# EAGLE schematic dedica interface board (EAGLE 9.3.2)

## Sheet 1 of 2
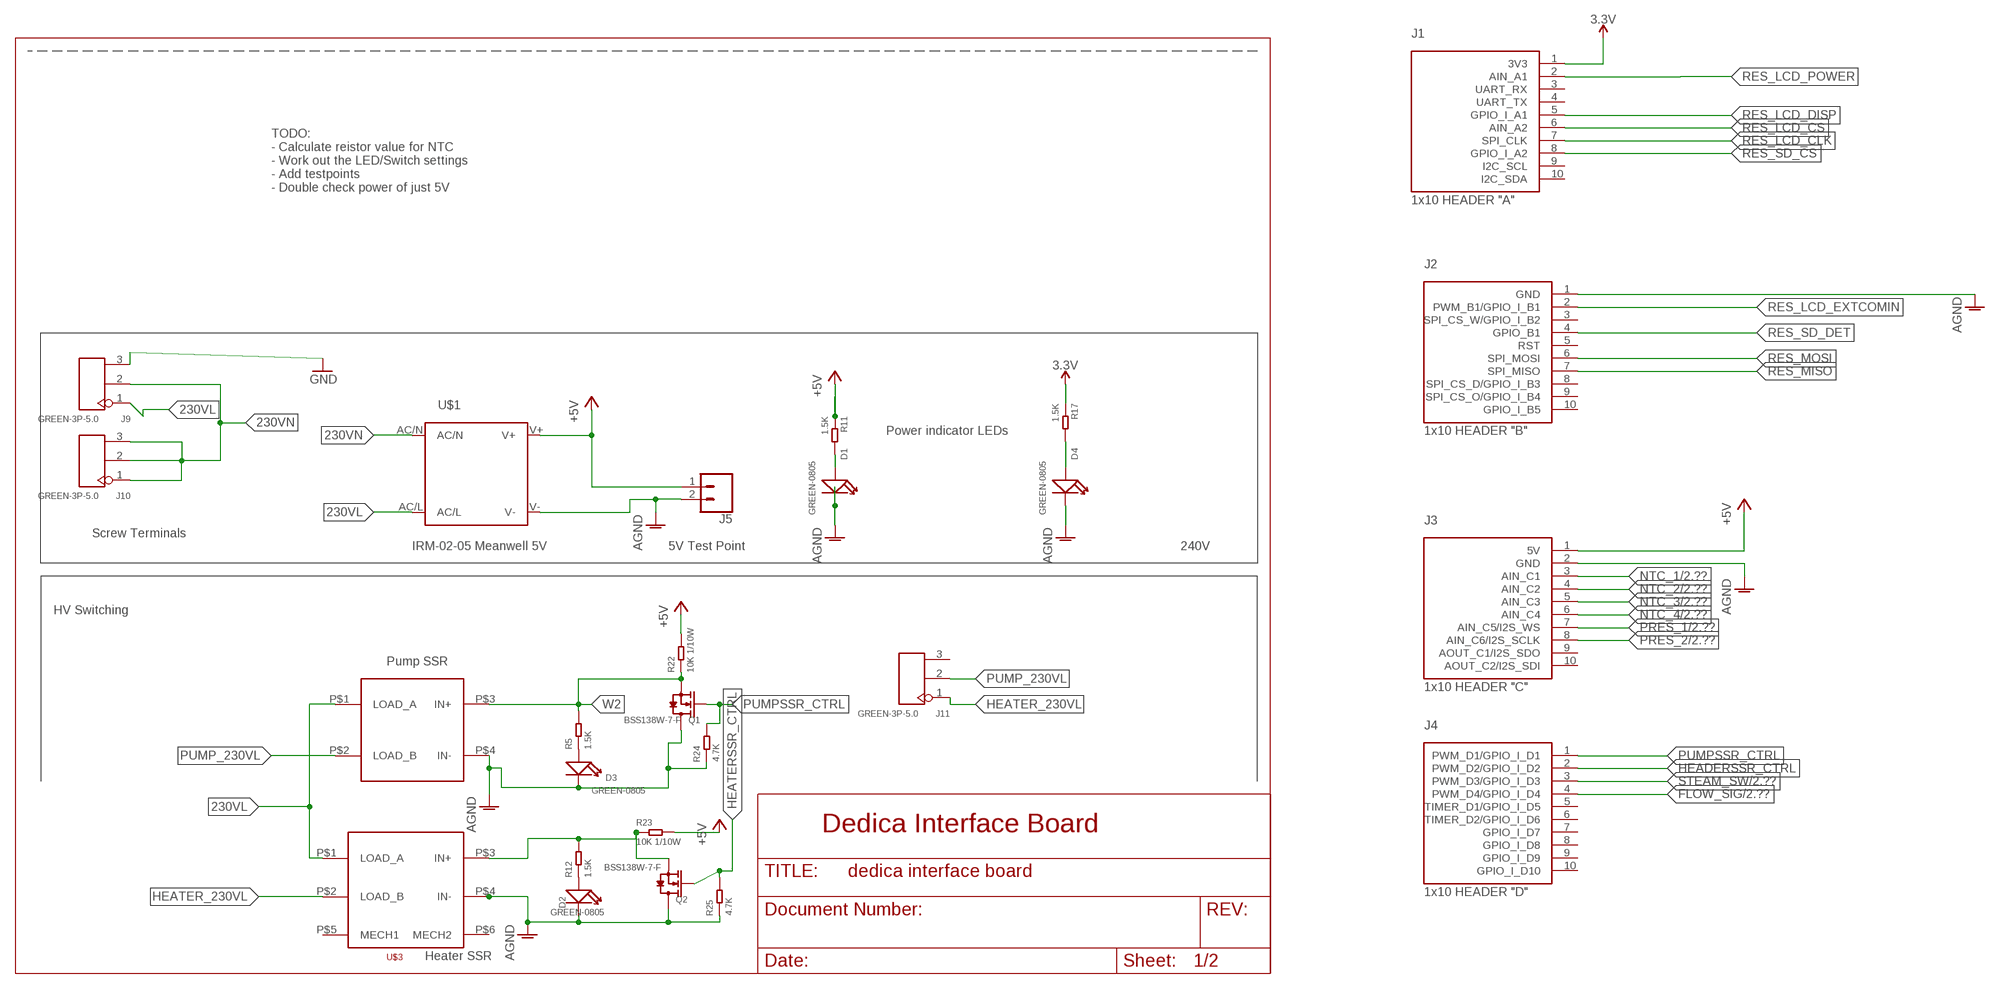
[diagram p0: schematic, sheet 1]

### Parts
D1  GREEN-0805  SMD-LED-CLEAR-GREEN(0805)  [LED-0805]
D2  GREEN-0805  SMD-LED-CLEAR-GREEN(0805)  [LED-0805]
D3  GREEN-0805  SMD-LED-CLEAR-GREEN(0805)  [LED-0805]
D4  GREEN-0805  SMD-LED-CLEAR-GREEN(0805)  [LED-0805]
J1  1x10 HEADER "A"  HEADER-1X10-J1  [1X10]
J2  1x10 HEADER "B"  HEADER-1X10-J2  [1X10]
J3  1x10 HEADER "C"  HEADER-1X10-J3  [1X10]
J4  1x10 HEADER "D"  HEADER-1X10-J4  [1X10]
J5  CONN_02  [1X02]
J9  GREEN-3P-5.0  SCREW-TERMINAL-GREEN(3P-5.0)  [H3-5.0-15.5X8.0MM]
J10  GREEN-3P-5.0  SCREW-TERMINAL-GREEN(3P-5.0)  [H3-5.0-15.5X8.0MM]
J11  GREEN-3P-5.0  SCREW-TERMINAL-GREEN(3P-5.0)  [H3-5.0-15.5X8.0MM]
Q1  BSS138W-7-F  SMD-MOSFET-N-CH-50V-200MA-BSS138W-7-F(SOT-23)  [SOT-23]
Q2  BSS138W-7-F  SMD-MOSFET-N-CH-50V-200MA-BSS138W-7-F(SOT-23)  [SOT-23]
R5  1.5K  SMD-RES-330R-5%-1/10W(0603)  [R0603]
R11  1.5K  SMD-RES-150R-5%-1/10W(0603)  [R0603]
R12  1.5K  SMD-RES-330R-5%-1/10W(0603)  [R0603]
R17  1.5K  SMD-RES-150R-5%-1/10W(0603)  [R0603]
R22  10K 1/10W  SMD-RES-10K-5%-1/10W(0603)  [R0603]
R23  10K 1/10W  SMD-RES-10K-5%-1/10W(0603)  [R0603]
R24  4.7K  SMD-RES-4.7K-5%-1/10W(0603)  [R0603]
R25  4.7K  SMD-RES-4.7K-5%-1/10W(0603)  [R0603]
U$1  IRM_01/02IRM_01/02  [IRM_01/02]
U$2  AQ3A2-ZT4/32VDC  [AQ3A2-ZT4/32VDC]
U$3  AQ10A2-ZT4/32VDC  [AQ10A2-ZT4/32VDC]

### Nets
3.3V: J1.1(3V3) R17.1 ; also sheet 2
230VL: J9.1 U$1.AC/L U$2.P$1(LOAD_A) U$3.P$1(LOAD_A)
230VN: J9.2 J10.1 J10.2 J10.3 U$1.AC/N
+5V: J3.1(5V) J5.1 R11.1 R22.2 R23.2 U$1.V+ ; also sheet 2
AGND: D1.- D2.- D3.- D4.- J2.1(GND) J3.2(GND) J5.2 Q1.3(D) Q2.3(D) R24.1 R25.1 U$1.V- U$2.P$4(IN-) U$3.P$4(IN-) ; also sheet 2
FLOW_SIG: J4.4(PWM_D4/GPIO_I_D4) ; also sheet 2
GND: J9.3
HEADERSSR_CTRL: J4.2(PWM_D2/GPIO_I_D2)
HEATER_230VL: J11.1 U$3.P$2(LOAD_B)
HEATERSSR_CTRL: Q2.1(G) R25.2
N$3: D1.+ R11.2
N$4: D3.+ R5.1
N$5: D2.+ R12.1
N$8: D4.+ R17.2
N$14: Q2.2(S) R12.2 R23.1 U$3.P$3(IN+)
NTC_1: J3.3(AIN_C1) ; also sheet 2
NTC_2: J3.4(AIN_C2) ; also sheet 2
NTC_3: J3.5(AIN_C3) ; also sheet 2
NTC_4: J3.6(AIN_C4) ; also sheet 2
PRES_1: J3.7(AIN_C5/I2S_WS) ; also sheet 2
PRES_2: J3.8(AIN_C6/I2S_SCLK) ; also sheet 2
PUMP_230VL: J11.2 U$2.P$2(LOAD_B)
PUMPSSR_CTRL: J4.1(PWM_D1/GPIO_I_D1) Q1.1(G) R24.2
RES_LCD_CLK: J1.7(SPI_CLK)
RES_LCD_CS: J1.6(AIN_A2)
RES_LCD_DISP: J1.5(GPIO_I_A1)
RES_LCD_EXTCOMIN: J2.2(PWM_B1/GPIO_I_B1)
RES_LCD_POWER: J1.2(AIN_A1)
RES_MISO: J2.7(SPI_MISO)
RES_MOSI: J2.6(SPI_MOSI)
RES_SD_CS: J1.8(GPIO_I_A2)
RES_SD_DET: J2.4(GPIO_B1)
STEAM_SW: J4.3(PWM_D3/GPIO_I_D3) ; also sheet 2
W2: Q1.2(S) R5.2 R22.1 U$2.P$3(IN+)
Unconnected: J1.3(UART_RX) J1.4(UART_TX) J1.9(I2C_SCL) J1.10(I2C_SDA) J2.3(SPI_CS_W/GPIO_I_B2) J2.5(RST) J2.8(SPI_CS_D/GPIO_I_B3) J2.9(SPI_CS_O/GPIO_I_B4) J2.10(GPIO_I_B5) J3.9(AOUT_C1/I2S_SDO) J3.10(AOUT_C2/I2S_SDI) J4.5(TIMER_D1/GPIO_I_D5) J4.6(TIMER_D2/GPIO_I_D6) J4.7(GPIO_I_D7) J4.8(GPIO_I_D8) J4.9(GPIO_I_D9) J4.10(GPIO_I_D10) J11.3 U$3.P$5(MECH1) U$3.P$6(MECH2)

### Notes on the sheet
- TODO: 
  - Calculate reistor value for NTC
  - Work out the LED/Switch settings
  - Add testpoints 
  - Double check power of just 5V
- Power indicator LEDs
- Screw Terminals
- IRM-02-05 Meanwell 5V | 5V Test Point | 240V
- HV Switching
- Pump SSR
- Dedica Interface Board
- Heater SSR

## Sheet 2 of 2
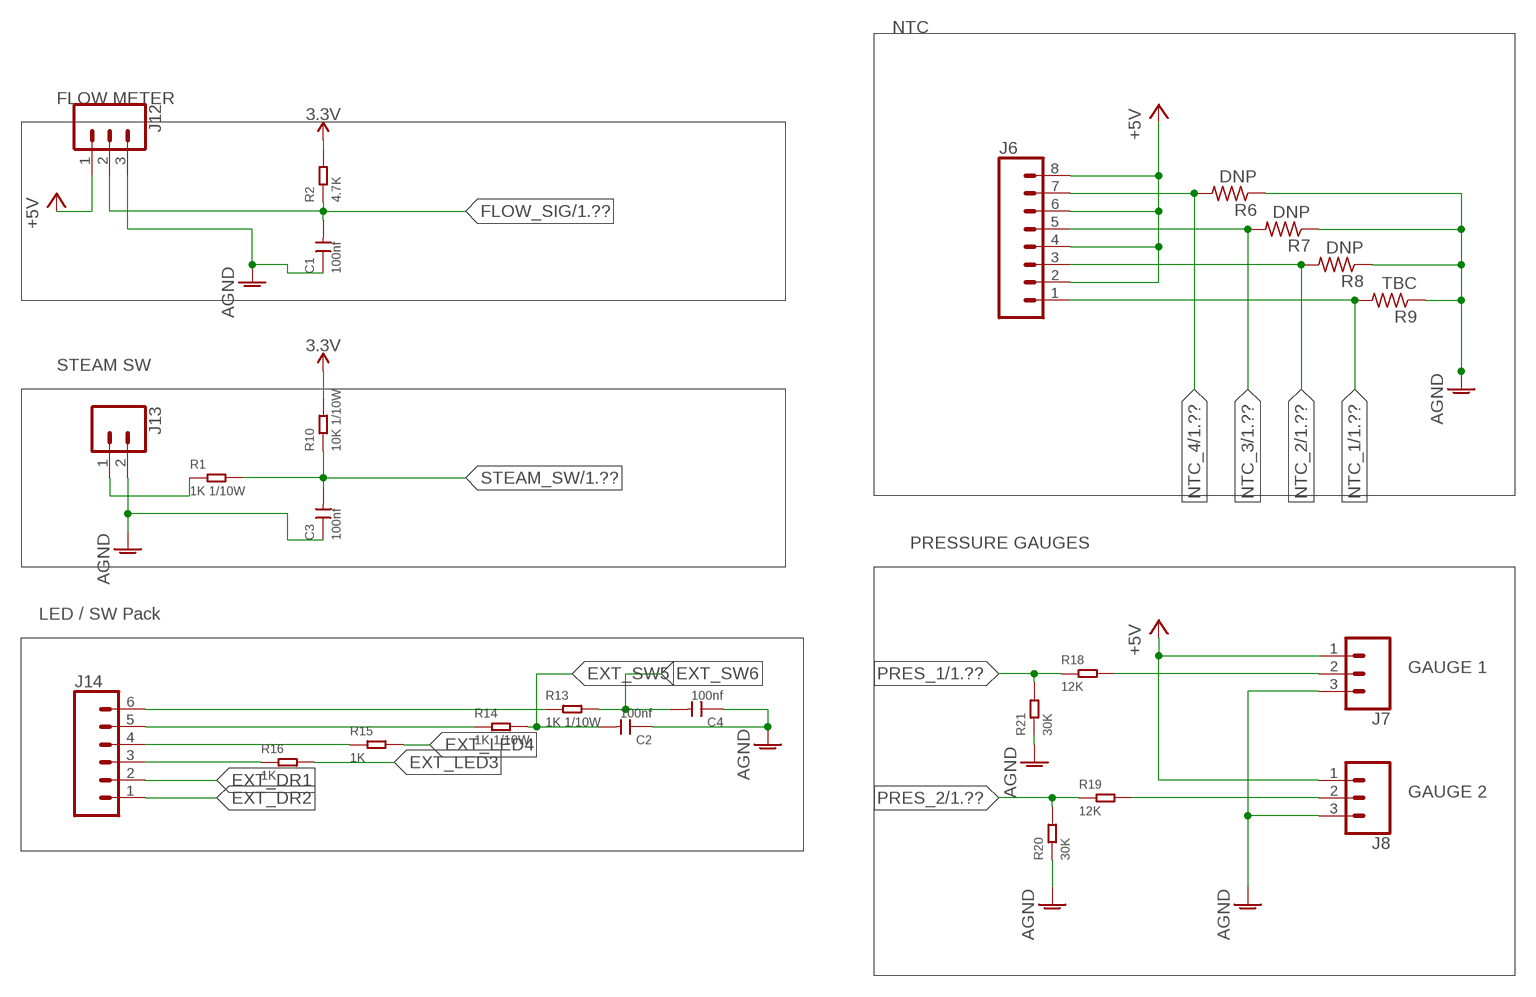
[diagram p1: schematic, sheet 2]

### Parts
C1  100nf  CERAMIC-100NF-50V-10%-X7R(0603)  [C0603]
C2  100nf  CERAMIC-100NF-50V-10%-X7R(0603)  [C0603]
C3  100nf  CERAMIC-100NF-50V-10%-X7R(0603)  [C0603]
C4  100nf  CERAMIC-100NF-50V-10%-X7R(0603)  [C0603]
J6  CONN_08"  [1X08]
J7  CONN_03  [1X03]
J8  CONN_03  [1X03]
J12  CONN_03  [1X03]
J13  CONN_02  [1X02]
J14  CONN_06LOCK  [1X06_LOCK]
R1  1K 1/10W  SMD-RES-1K-5%-1/10W(0603)  [R0603]
R2  4.7K  SMD-RES-4.7K-5%-1/10W(0603)  [R0603]
R6  DNP  R-US_R0603  [R0603]
R7  DNP  R-US_R0603  [R0603]
R8  DNP  R-US_R0603  [R0603]
R9  TBC  R-US_R0603  [R0603]
R10  10K 1/10W  SMD-RES-10K-5%-1/10W(0603)  [R0603]
R13  1K 1/10W  SMD-RES-1K-5%-1/10W(0603)  [R0603]
R14  1K 1/10W  SMD-RES-1K-5%-1/10W(0603)  [R0603]
R15  1K  SMD-RES-330R-5%-1/8W(0805)  [R0805]
R16  1K  SMD-RES-330R-5%-1/8W(0805)  [R0805]
R18  12K  SMD-RES-12K-1%-1/10W(0603)  [R0603]
R19  12K  SMD-RES-12K-1%-1/10W(0603)  [R0603]
R20  30K  SMD-RES-30K-1%-1/10W(0603)  [R0603]
R21  30K  SMD-RES-30K-1%-1/10W(0603)  [R0603]

### Nets
3.3V: R2.2 R10.2 ; also sheet 1
+5V: J6.2 J6.4 J6.6 J6.8 J7.1 J8.1 J12.1 ; also sheet 1
AGND: C1.1 C2.1 C3.1 C4.1 J7.3 J8.3 J12.3 J13.2 R6.1 R7.1 R8.1 R9.1 R20.1 R21.1 ; also sheet 1
EXT_DR1: J14.2
EXT_DR2: J14.1
EXT_LED3: R16.2
EXT_LED4: R15.2
EXT_SW5: C2.2 R14.2
EXT_SW6: C4.2 R13.2
FLOW_SIG: C1.2 J12.2 R2.1 ; also sheet 1
N$1: J13.1 R1.1
N$6: J14.6 R13.1
N$7: J14.5 R14.1
N$10: J14.4 R15.1
N$11: J14.3 R16.1
NTC_1: J6.1 R9.2 ; also sheet 1
NTC_2: J6.3 R8.2 ; also sheet 1
NTC_3: J6.5 R7.2 ; also sheet 1
NTC_4: J6.7 R6.2 ; also sheet 1
PGAUGE_1: J7.2 R18.2
PGAUGE_2: J8.2 R19.2
PRES_1: R18.1 R21.2 ; also sheet 1
PRES_2: R19.1 R20.2 ; also sheet 1
STEAM_SW: C3.2 R1.2 R10.1 ; also sheet 1

### Notes on the sheet
- NTC
- FLOW METER
- STEAM SW
- PRESSURE GAUGES
- LED / SW Pack
- GAUGE 1
- GAUGE 2

## Library data of the parts
C1-C4 = OPL_Capacitor:CERAMIC-100NF-50V-10%-X7R(0603): 302010138; MPN: CC0603KRX7R9BB104
D1-D4 = OPL_Optoelectronics:SMD-LED-CLEAR-GREEN(0805): 304090057; MPN: 17-215SYGC/S530-E2/TR8
J1 = CCo-Boost:HEADER-1X10-J1: 1x10 BoosterPack Header J1 This 1x10 header matches the pinout of J1 header of the BoosterPack Pinout Standard.
J2 = CCo-Boost:HEADER-1X10-J2: 1x10 BoosterPack Header J2 This 1x10 header matches the pinout of J2 header of the BoosterPack Pinout Standard.
J3 = CCo-Boost:HEADER-1X10-J3: 1x10 BoosterPack Header J3 This 1x10 header matches the pinout of J3 header of the BoosterPack Pinout Standard.
J4 = CCo-Boost:HEADER-1X10-J4: 1x10 BoosterPack Header J4 This 1x10 header matches the pinout of J4 header of the BoosterPack Pinout Standard.
J5 J13 = SparkFun-Connectors:CONN_02: Multi connection point. Often used as Generic Header-pin footprint for 0.1 inch spaced/style header connections On any of the 0.1 inch spaced packages, you can populate with these: Break Away Headers - Straight <https://www.sparkfun.com/products/116> (PRT-00116) Break Away Male Headers - Right Angle <https://www.sparkfun.com/products/553> (PRT-00553) Female Headers <https://www.sparkfun.com/products/115> (PRT-00115) Break Away Headers - Machine Pin <https://www.sparkfun.com/products/117> (PRT-00117) Break Away Female Headers - Swiss Machine Pin <https://www.sparkfun.com/products/743> (PRT-00743) For SCREWTERMINALS and SPRING TERMINALS visit here: Screw Terimnals on SparkFun.com <https://www.sparkfun.com/search/results?term=Screw+Terminals> (5mm/3.5mm/2.54mm spacing) This device is also useful as a general connection point to wire up your design to another part of your project. Our various solder wires solder well into these plated through hole pads. Hook-Up Wire - Assortment (Stranded, 22 AWG) <https://www.sparkfun.com/products/11375> (PRT-11375) Hook-Up Wire - Assortment (Solid Core, 22 AWG) <https://www.sparkfun.com/products/11367> (PRT-11367) View the entire wire category on our website here <https://www.sparkfun.com/categories/141> Special notes: Molex polarized connector foot print use with: PRT-08233 with associated crimp pins and housings. 2.54_SCREWTERM for use with PRT-10571. 3.5mm Screw Terminal footprints for PRT-08084 5mm Screw Terminal footprints for use with PRT-08432
J6 = SparkFun-Connectors:CONN_08: Multi connection point. Often used as Generic Header-pin footprint for 0.1 inch spaced/style header connections On any of the 0.1 inch spaced packages, you can populate with these: Break Away Headers - Straight <https://www.sparkfun.com/products/116> (PRT-00116) Break Away Male Headers - Right Angle <https://www.sparkfun.com/products/553> (PRT-00553) Female Headers <https://www.sparkfun.com/products/115> (PRT-00115) Break Away Headers - Machine Pin <https://www.sparkfun.com/products/117> (PRT-00117) Break Away Female Headers - Swiss Machine Pin <https://www.sparkfun.com/products/743> (PRT-00743) Arduino Stackable Header - 8 Pin <https://www.sparkfun.com/products/9279> (PRT-09279) For SCREWTERMINALS and SPRING TERMINALS visit here: Screw Terimnals on SparkFun.com <https://www.sparkfun.com/search/results?term=Screw+Terminals> (5mm/3.5mm/2.54mm spacing) This device is also useful as a general connection point to wire up your design to another part of your project. Our various solder wires solder well into these plated through hole pads. Hook-Up Wire - Assortment (Stranded, 22 AWG) <https://www.sparkfun.com/products/11375> (PRT-11375) Hook-Up Wire - Assortment (Solid Core, 22 AWG) <https://www.sparkfun.com/products/11367> (PRT-11367) View the entire wire category on our website here <https://www.sparkfun.com/categories/141> Special notes: Molex polarized connector foot print use with SKU : PRT-08231 with associated crimp pins and housings. 1MM SMD Version SKU: PRT-10208 NOTES ON THE VARIANTS LOCK and LOCK_LONGPADS... This footprint was designed to help hold the alignment of a through-hole component (i.e. 6-pin header) while soldering it into place. You may notice that each hole has been shifted either up or down by 0.005 of an inch from it's more standard position (which is a perfectly straight line). This slight alteration caused the pins (the squares in the middle) to touch the edges of the holes. Because they are alternating, it causes a "brace" to hold the component in place. 0.005 has proven to be the perfect amount of "off-center" position when using our standard breakaway headers. Although looks a little odd when you look at the bare footprint, once you have a header in there, the alteration is very hard to notice. Also,if you push a header all the way into place, it is covered up entirely on the bottom side.; PROD_ID: CONN-08438
J7 J8 J12 = SparkFun-Connectors:CONN_03: Multi connection point. Often used as Generic Header-pin footprint for 0.1 inch spaced/style header connections On any of the 0.1 inch spaced packages, you can populate with these: Break Away Headers - Straight <https://www.sparkfun.com/products/116> (PRT-00116) Break Away Male Headers - Right Angle <https://www.sparkfun.com/products/553> (PRT-00553) Female Headers <https://www.sparkfun.com/products/115> (PRT-00115) Break Away Headers - Machine Pin <https://www.sparkfun.com/products/117> (PRT-00117) Break Away Female Headers - Swiss Machine Pin <https://www.sparkfun.com/products/743> (PRT-00743) Stackable Header - 3 Pin (Female, 0.1") <https://www.sparkfun.com/products/13875> (PRT-13875) For SCREWTERMINALS and SPRING TERMINALS visit here: Screw Terimnals on SparkFun.com <https://www.sparkfun.com/search/results?term=Screw+Terminals> (5mm/3.5mm/2.54mm spacing) This device is also useful as a general connection point to wire up your design to another part of your project. Our various solder wires solder well into these plated through hole pads. Hook-Up Wire - Assortment (Stranded, 22 AWG) <https://www.sparkfun.com/products/11375> (PRT-11375) Hook-Up Wire - Assortment (Solid Core, 22 AWG) <https://www.sparkfun.com/products/11367> (PRT-11367) View the entire wire category on our website here <https://www.sparkfun.com/categories/141> Special notes: Molex polarized connector foot print use with SKU : PRT-08232 with associated crimp pins and housings.
J9-J11 = OPL_Connector:SCREW-TERMINAL-GREEN(3P-5.0): 320110029
J14 = SparkFun-Connectors:CONN_06: Multi connection point. Often used as Generic Header-pin footprint for 0.1 inch spaced/style header connections On any of the 0.1 inch spaced packages, you can populate with these: Break Away Headers - Straight <https://www.sparkfun.com/products/116> (PRT-00116) Break Away Male Headers - Right Angle <https://www.sparkfun.com/products/553> (PRT-00553) Female Headers <https://www.sparkfun.com/products/115> (PRT-00115) Break Away Headers - Machine Pin <https://www.sparkfun.com/products/117> (PRT-00117) Break Away Female Headers - Swiss Machine Pin <https://www.sparkfun.com/products/743> (PRT-00743) Arduino Stackable Header - 6 Pin <https://www.sparkfun.com/products/9280> (PRT-09280) For SCREWTERMINALS and SPRING TERMINALS visit here: Screw Terimnals on SparkFun.com <https://www.sparkfun.com/search/results?term=Screw+Terminals> (5mm/3.5mm/2.54mm spacing) This device is also useful as a general connection point to wire up your design to another part of your project. Our various solder wires solder well into these plated through hole pads. Hook-Up Wire - Assortment (Stranded, 22 AWG) <https://www.sparkfun.com/products/11375> (PRT-11375) Hook-Up Wire - Assortment (Solid Core, 22 AWG) <https://www.sparkfun.com/products/11367> (PRT-11367) View the entire wire category on our website here <https://www.sparkfun.com/categories/141>
Q1 Q2 = OPL_Discrete_Semiconductor:SMD-MOSFET-N-CH-50V-200MA-BSS138W-7-F(SOT-23): 305030000; MPN: BSS138W-7-F
R1 R13 R14 = OPL_Resistor:SMD-RES-1K-5%-1/10W(0603): 301010291; MPN: RC0603JR-071KL
R2 R24 R25 = OPL_Resistor:SMD-RES-4.7K-5%-1/10W(0603): 301010290; MPN: RC0603JR-074K7L
R5 R12 = OPL_Resistor:SMD-RES-330R-5%-1/10W(0603): 301012123; MPN: RC0603FR-071K5L
R6-R9 = adafruit:R-US_: RESISTOR, American symbol
R10 R22 R23 = OPL_Resistor:SMD-RES-10K-5%-1/10W(0603): 301010293; MPN: RC0603JR-0710KL
R11 R17 = OPL_Resistor:SMD-RES-150R-5%-1/10W(0603): 301012106; MPN: RC0603FR-071K5L
R15 R16 = OPL_Resistor:SMD-RES-330R-5%-1/8W(0805): 301012196; MPN: RC0805JR-071KL
R18 R19 = OPL_Resistor:SMD-RES-12K-1%-1/10W(0603): 301012034; MPN: RC0603FR-0712KL
R20 R21 = OPL_Resistor:SMD-RES-30K-1%-1/10W(0603): 301012064; MPN: RC0603FR-0730KL
U$1 = meanwell_irm_v7:IRM_01/02: 1 or 2 watt housing & pin compatible IRM 01 Vout [V] Imax [A] Pmax [W] Eff [%] 3.3 0.3 1 66 5 0.2 1 70 9 0.111 1 72 12 0.083 1 74 15 0.067 1 75 24 0.042 1 77 IRM 2 Vout [V] Imax [A] Pmax [W] Eff [%] 3.3 0.6 2 66 5 0.4 2 70 9 0.222 2 72 12 0.167 2 74 15 0.133 2 75 24 0.087 2 77
U$2 = PanasonicAQ1:AQ3A2-ZT4/32VDC
U$3 = PanasonicAQ1:AQ10A2-ZT4/32VDC